# Altium schematic sheet REVISION HISTORY.SchDoc
size A; SheetNumber: 3; SheetTotal: 3
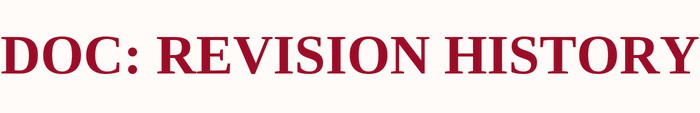
[diagram p0: REVISION HISTORY.SchDoc]

## Notes on the sheet
- DOC: REVISION HISTORY